# EAGLE design rect_and_stab (EAGLE 7.5.0)
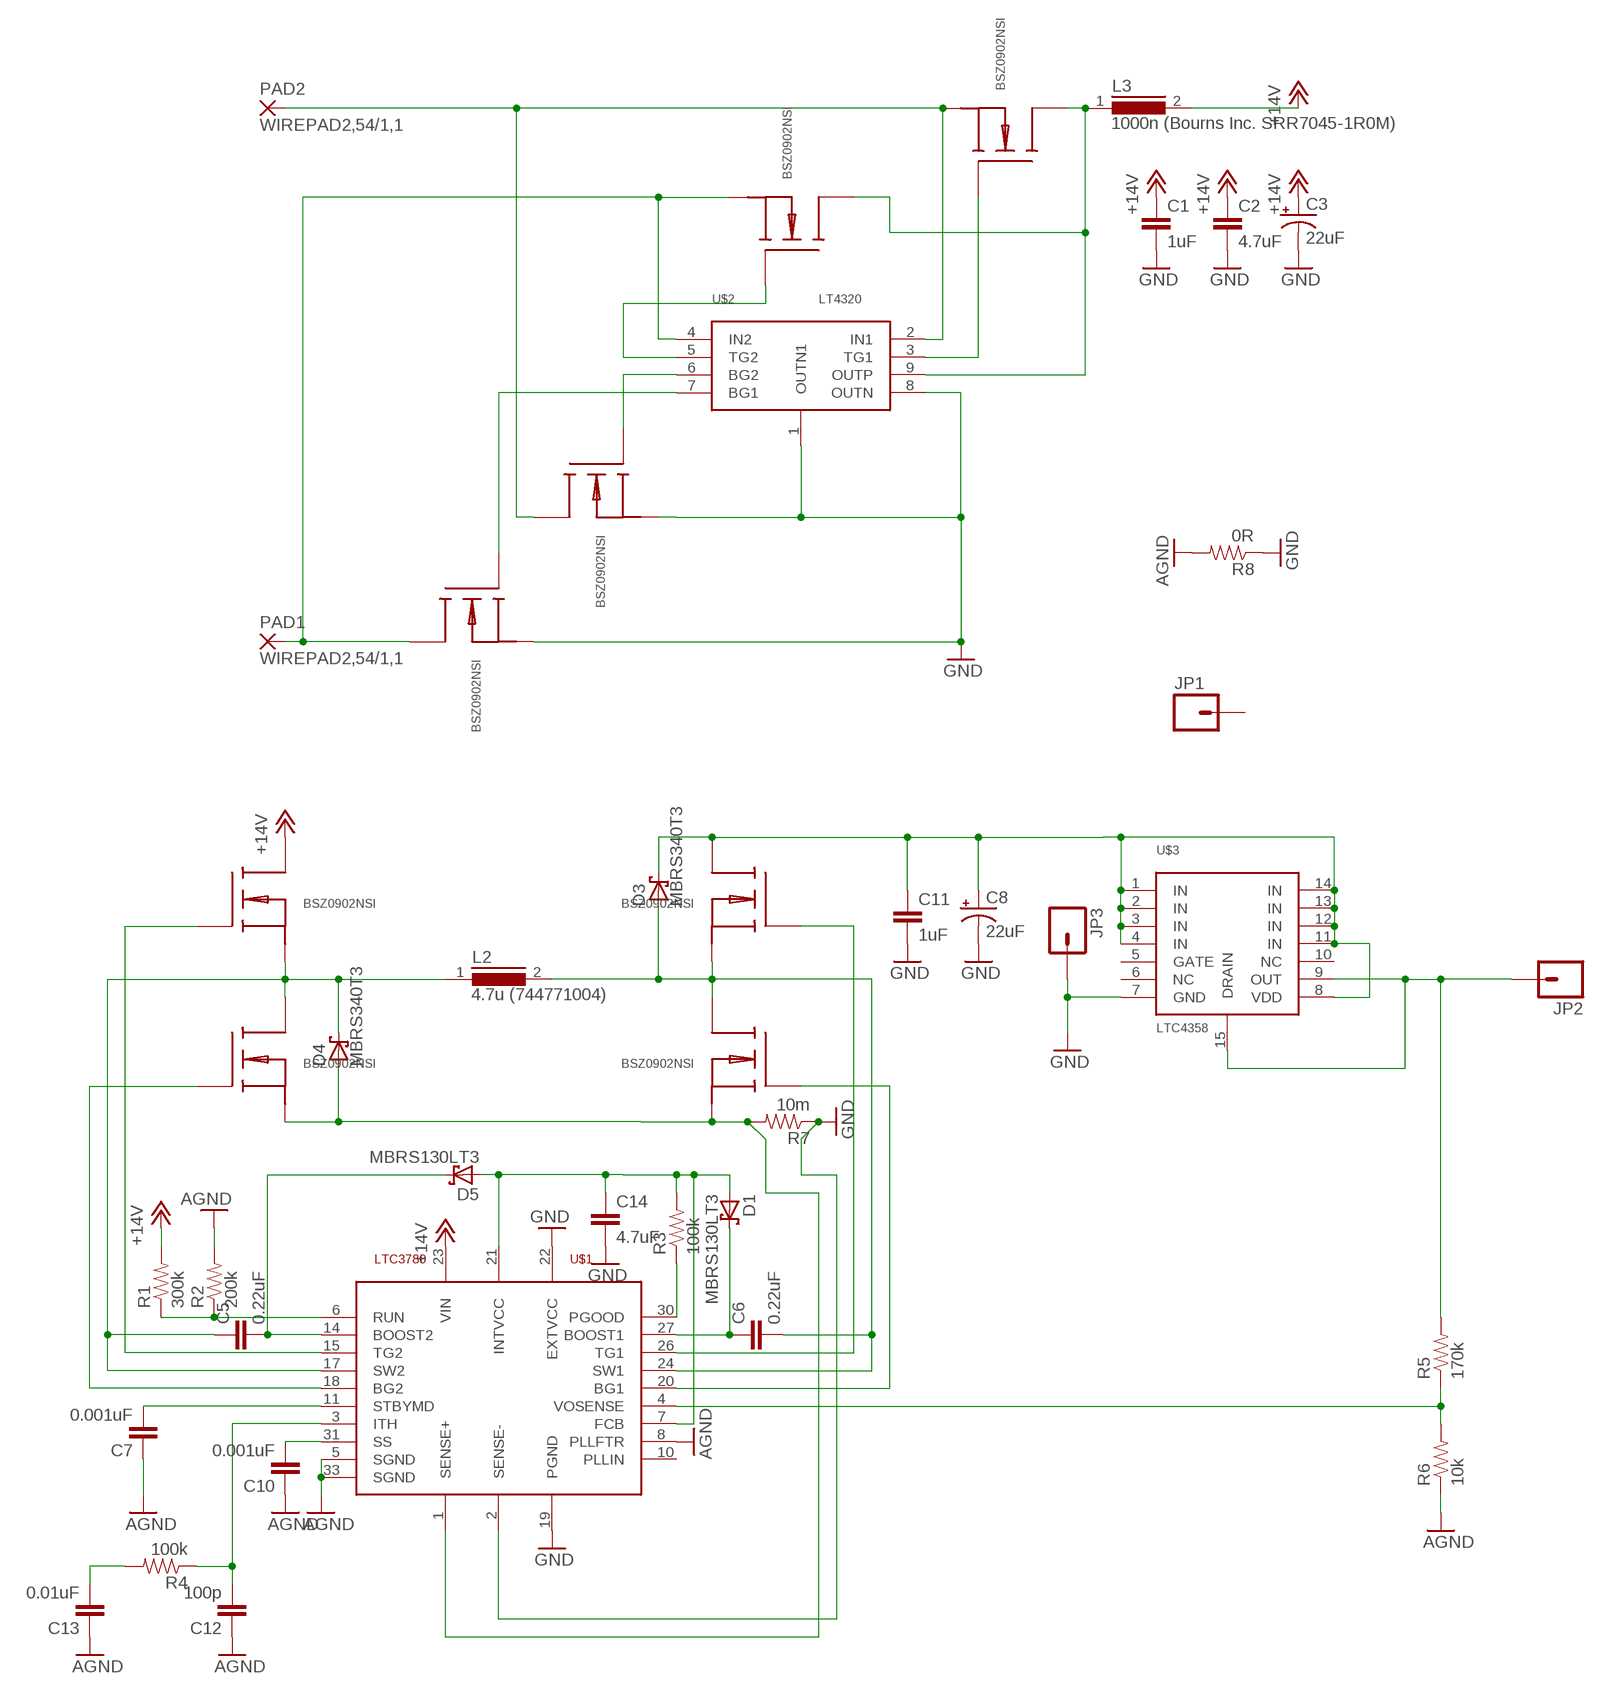
[diagram p0: schematic, sheet 1]

## Parts
C1  1uF  CAP0603-CAP  [0603-CAP]
C2  4.7uF  CAP1210  [1210]
C3  22uF  CAP_POL7343  [EIA7343]
C5  0.22uF  CAP0603-CAP  [0603-CAP]
C6  0.22uF  CAP0603-CAP  [0603-CAP]
C7  0.001uF  0.1UF-16V(+-10%)(0402)  [0402-CAP]
C8  22uF  CAP_POL7343  [EIA7343]
C10  0.001uF  0.1UF-16V(+-10%)(0402)  [0402-CAP]
C11  1uF  CAP0603-CAP  [0603-CAP]
C12  100p  0.1UF-16V(+-10%)(0402)  [0402-CAP]
C13  0.01uF  0.1UF-16V(+-10%)(0402)  [0402-CAP]
C14  4.7uF  CAP1210  [1210]
D1  MBRS130LT3  [SMB]
D3  MBRS340T3  [SMC]
D4  MBRS340T3  [SMC]
D5  MBRS130LT3  [SMB]
JP1  M01PTH_2MM  [1X01_2MM]
JP2  M01PTH_2MM  [1X01_2MM]
JP3  M01PTH_2MM  [1X01_2MM]
L2  4.7u (744771004)  DR127  [DR127]
L3  1000n (Bourns Inc. SRR7045-1R0M)  DR74  [DR74]
PAD1  WIREPAD2,54/1,1  [2,54/1,1]
PAD2  WIREPAD2,54/1,1  [2,54/1,1]
Q1  BSZ0902NSI  BSZ090X  [BSZ090X]
Q2  BSZ0902NSI  BSZ090X  [BSZ090X]
Q3  BSZ0902NSI  BSZ090X  [BSZ090X]
Q4  BSZ0902NSI  BSZ090X  [BSZ090X]
Q5  BSZ0902NSI  BSZ090X  [BSZ090X]
Q6  BSZ0902NSI  BSZ090X  [BSZ090X]
Q7  BSZ0902NSI  BSZ090X  [BSZ090X]
Q8  BSZ0902NSI  BSZ090X  [BSZ090X]
R1  300k  RESISTOR0402-RES  [0402-RES]
R2  200k  RESISTOR0402-RES  [0402-RES]
R3  100k  RESISTOR0402-RES  [0402-RES]
R4  100k  RESISTOR0402-RES  [0402-RES]
R5  170k  RESISTOR0402-RES  [0402-RES]
R6  10k  RESISTOR0402-RES  [0402-RES]
R7  10m  RESISTOR2010  [R2010]
R8  0R  RESISTOR0402-RES  [0402-RES]
U$1  LTC3780  [LTC3780]
U$2  LT4320  [LT4320]
U$3  LTC4358  [LTC4358]

## Nets
+12V [HI_PWR]: C1.1 C2.1 C3.A(+) L3.2 Q6.D Q6.D@1(D) Q6.D@2(D) Q6.D@3(D) Q6.D@4(D) R1.2 U$1.23(VIN) ; supply symbol labelled +14V
AGND: C7.1 C10.1 C12.1 C13.1 R2.2 R6.1 R8.2 U$1.5(SGND) U$1.8(PLLFTR) U$1.33(SGND)
GND [HI_PWR]: C1.2 C2.2 C3.C(-) C8.C(-) C11.2 C14.2 JP3.1 Q1.S@1(S) Q1.S@2(S) Q1.S@3(S) Q1.S@4(S) Q3.S@1(S) Q3.S@2(S) Q3.S@3(S) Q3.S@4(S) R7.1 R8.1 U$1.2(SENSE-) U$1.19(PGND) U$1.22(EXTVCC) U$2.1(OUTN1) U$2.8(OUTN) U$3.7(GND)
N$1 [HI_PWR]: Q2.G U$2.5(TG2)
N$2 [HI_PWR]: PAD1.1(P) Q2.S@1(S) Q2.S@2(S) Q2.S@3(S) Q2.S@4(S) Q3.D Q3.D@1(D) Q3.D@2(D) Q3.D@3(D) Q3.D@4(D) U$2.4(IN2)
N$3 [HI_PWR]: Q3.G U$2.7(BG1)
N$4: C7.2 U$1.11(STBYMD)
N$5: C6.1 D1.C U$1.27(BOOST1)
N$6 [HI_PWR]: Q1.G U$2.6(BG2)
N$7 [HI_PWR]: PAD2.1(P) Q1.D Q1.D@1(D) Q1.D@2(D) Q1.D@3(D) Q1.D@4(D) Q4.S@1(S) Q4.S@2(S) Q4.S@3(S) Q4.S@4(S) U$2.2(IN1)
N$8 [HI_PWR]: Q4.G U$2.3(TG1)
N$9 [HI_PWR]: L3.1 Q2.D Q2.D@1(D) Q2.D@2(D) Q2.D@3(D) Q2.D@4(D) Q4.D Q4.D@1(D) Q4.D@2(D) Q4.D@3(D) Q4.D@4(D) U$2.9(OUTP)
N$10: Q7.G U$1.20(BG1)
N$11 [HI_PWR]: C6.2 D3.A L2.2 Q7.D Q7.D@1(D) Q7.D@2(D) Q7.D@3(D) Q7.D@4(D) Q8.S@1(S) Q8.S@2(S) Q8.S@3(S) Q8.S@4(S) U$1.24(SW1)
N$12: C10.2 U$1.31(SS)
N$13 [HI_PWR]: JP2.1 R5.2 U$3.9(OUT) U$3.15(DRAIN)
N$14: Q8.G U$1.26(TG1)
N$15: Q5.G U$1.18(BG2)
N$16 [HI_PWR]: C5.1 D4.C L2.1 Q5.D Q5.D@1(D) Q5.D@2(D) Q5.D@3(D) Q5.D@4(D) Q6.S@1(S) Q6.S@2(S) Q6.S@3(S) Q6.S@4(S) U$1.17(SW2)
N$17 [HI_PWR]: Q6.G U$1.15(TG2)
N$18: C5.2 D5.C U$1.14(BOOST2)
N$19: R5.1 R6.2 U$1.4(VOSENSE)
N$20: R1.1 R2.1 U$1.6(RUN)
N$21: R3.1 U$1.30(PGOOD)
N$22 [HI_PWR]: C8.A(+) C11.1 D3.C Q8.D Q8.D@1(D) Q8.D@2(D) Q8.D@3(D) Q8.D@4(D) U$3.1(IN) U$3.2(IN) U$3.3(IN) U$3.4(IN) U$3.8(VDD) U$3.11(IN) U$3.12(IN) U$3.13(IN) U$3.14(IN)
N$23 [HI_PWR]: D4.A Q5.S@1(S) Q5.S@2(S) Q5.S@3(S) Q5.S@4(S) Q7.S@1(S) Q7.S@2(S) Q7.S@3(S) Q7.S@4(S) R7.2 U$1.1(SENSE+)
N$24: C13.2 R4.2
N$25: C12.2 R4.1 U$1.3(ITH)
N$26: C14.1 D1.A D5.A R3.2 U$1.7(FCB) U$1.21(INTVCC)
Unconnected: JP1.1 U$1.9(NC) U$1.10(PLLIN) U$1.12(NC) U$1.13(NC) U$1.16(NC) U$1.25(NC) U$1.28(NC) U$1.29(NC) U$1.32(NC) U$3.5(GATE) U$3.6(NC) U$3.10(NC)

## Library data of the parts
C1 C2 C5 C6 C11 C14 = SparkFun-Passives:CAP: Capacitor Standard 0603 ceramic capacitor, and 0.1" leaded capacitor.
C3 C8 = SparkFun-Passives:CAP_POL: Capacitor Polarized These are standard SMD and PTH capacitors. Normally 10uF, 47uF, and 100uF in electrolytic and tantalum varieties. Always verify the external diameter of the through hole cap, it varies with capacity, voltage, and manufacturer. The EIA devices should be standard.
C7 C10 C12 C13 = SparkFun-Capacitors:0.1UF-16V(+-10%)(0402); PROD_ID: CAP-12416; VALUE: 0.1uF
D1 D5 = diode:MBRS130LT3: Schottky Power Rectifier Source: http://www.onsemi.com/pub/Collateral/MBRS130LT3-D.PDF
D3 D4 = diode:MBRS3*0T3: SCHOTTKY BARRIER RECTIFIER 3.0 AMPERES 20, 30, 40 VOLT Source: MBRS340T3-D.pdf
JP1-JP3 = SparkFun-Connectors:M01: Header 1 Standard 1-pin 0.1" header. Use with straight break away headers (SKU : PRT-00116), right angle break away headers (PRT-00553), swiss pins (PRT-00743), machine pins (PRT-00117), and female headers (PRT-00115).
L2 = inductors:DR127: High Power Density, High Efficiency, Shielded Inductors Source: coiltronics_dr_series.pdf
L3 = inductors:DR74: High Power Density, High Efficiency, Shielded Inductors Source: coiltronics_dr_series.pdf
PAD1 PAD2 = wirepad:WIREPAD: Wire PAD connect wire on PCB
Q1-Q8 = vsd_custom:BSZ090X
R1-R8 = SparkFun-Passives:RESISTOR: Resistor Basic schematic elements and footprints for 0603, 1206, and PTH resistors.
U$1 = ltc3780:LTC3780
U$2 = lt4320:LT4320
U$3 = ltc4358:LTC4358

## Net classes
1 HI_PWR: width 0.3 mm, drill 0.4 mm, clearance 0.178 mm

## Board
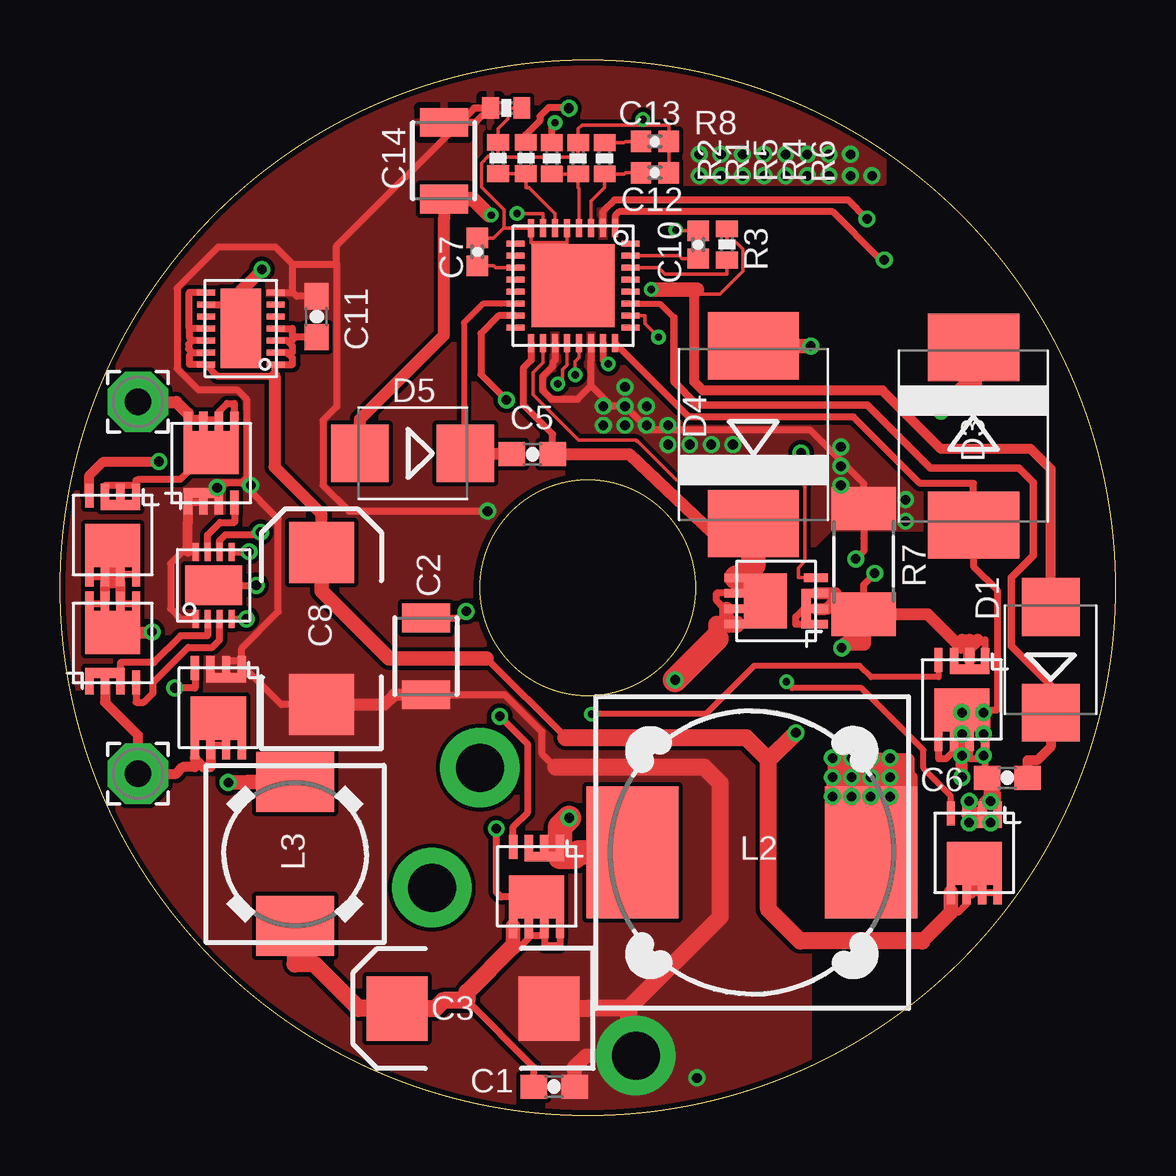
[diagram p1: board, top side]
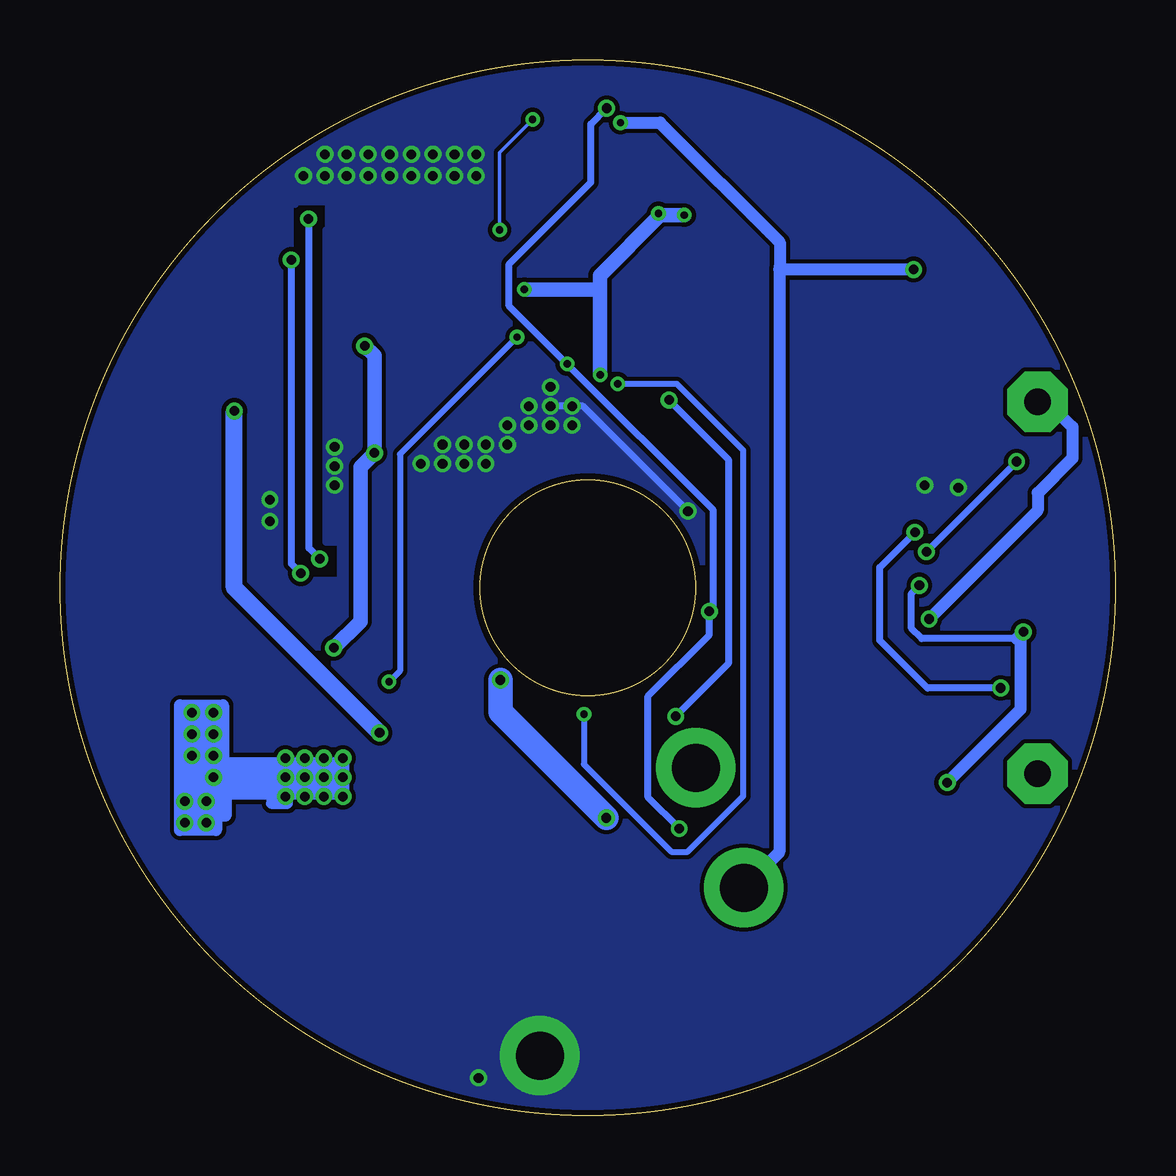
[diagram p2: board, bottom side, seen from below]

Size 44 x 44 mm. Coordinates in mm from the lower left corner, seen from the top.
Outline: circle at 22,22 radius 22
Outline: circle at 22,22 radius 4.5
Copper layers (1*16): Top 0.035mm / dielectric 1.5mm / Bottom 0.035mm
Design rules "SeeedStudio_2layer_DRU_no_angle_20140221": minimum track width 6mil, minimum drill 12mil, track to track 6mil, track to pad 6mil, pad to pad 6mil, via to via 6mil, smd to smd 0mil, copper to edge 10mil, drill to drill 10mil, minimum pad ring 10mil, minimum via ring 6mil, stop-mask expansion 2mil, vias tented up to drill 100mil, thermal gap 10mil

### Footprints (pad centres in the part's own frame; a part is rotated, then mirrored left to right if it is on the bottom)
0603-CAP = smd 1.1 x 1: 1 -0.85,0; 2 0.85,0
1210 = smd 1.2 x 2: 1 -1.6,0; 2 1.6,0
EIA7343 = smd 2.55 x 2.7: A 3.17,0; C -3.17,0
0402-CAP = smd 0.85 x 0.9: 1 -0.58,0; 2 0.58,0
SMB = smd 2.4 x 2.4: A 2.2,0; C -2.2,0
SMC = smd 2.8 x 3.8: A 3.7,0; C -3.7,0
1X01_2MM = drill 2 pad 3.302: 1 0,0
DR127 = smd 3.85 x 5.5: 1 -4.975,0; 2 4.975,0
DR74 = smd 2.5 x 3.25: 1 -3,0; 2 3,0
2,54/1,1 = drill 1.118 pad 2.54 octagon: 1 0,0
BSZ090X = smd 1.8 x 2.3: D 0.44,0 | smd 1 x 0.35: D@1 1.65,-0.975; D@2 1.65,-0.325; D@3 1.65,0.325; D@4 1.65,0.975; G -1.65,-0.975; S@2 -1.65,-0.325; S@3 -1.65,0.325; S@4 -1.65,0.975 | smd 0.4 x 1.65: S@1 -1.25,0.325
0402-RES = smd 0.7 x 0.9: 1 -0.65,0; 2 0.65,0
R2010 = smd 1.8 x 2.7: 1 -2.2,0; 2 2.2,0
LTC3780 = smd 0.75 x 0.25: 1 -2.4,1.75; 2 -2.4,1.25; 3 -2.4,0.75; 4 -2.4,0.25; 5 -2.4,-0.25; 6 -2.4,-0.75; 7 -2.4,-1.25; 8 -2.4,-1.75; 17 2.4,-1.75; 18 2.4,-1.25; 19 2.4,-0.75; 20 2.4,-0.25; 21 2.4,0.25; 22 2.4,0.75; 23 2.4,1.25; 24 2.4,1.75 | smd 0.25 x 0.75: 9 -1.75,-2.4; 10 -1.25,-2.4; 11 -0.75,-2.4; 12 -0.25,-2.4; 13 0.25,-2.4; 14 0.75,-2.4; 15 1.25,-2.4; 16 1.75,-2.4; 25 1.75,2.4; 26 1.25,2.4; 27 0.75,2.4; 28 0.25,2.4; 29 -0.25,2.4; 30 -0.75,2.4; 31 -1.25,2.4; 32 -1.75,2.4 | smd 3.45 x 3.45: 33 0,0
LT4320 = smd 0.25 x 0.75: 1 -0.75,-1.4; 2 -0.25,-1.4; 3 0.25,-1.4; 4 0.75,-1.4; 5 0.75,1.4; 6 0.25,1.4; 7 -0.25,1.4; 8 -0.75,1.4 | smd 2.38 x 1.65: 9 0,0
LTC4358 = smd 0.25 x 0.75: 1 -1.5,-1.45; 2 -1,-1.45; 3 -0.5,-1.45; 4 0,-1.45; 5 0.5,-1.45; 6 1,-1.45; 7 1.5,-1.45; 8 1.5,1.45; 9 1,1.45; 10 0.5,1.45; 11 0,1.45; 12 -0.5,1.45; 13 -1,1.45; 14 -1.5,1.45 | smd 3.3 x 1.7: 15 0,0

### Placement (x,y rotation side)
C1  20.6,1.2 0 top
C2  15.25,19.14 270 top
C3  17.22,4.46 180 top
C5  19.69,27.57 180 top
C6  39.49,14.08 180 top
C7  17.4,36 270 top
C8  10.9,20.3 90 top
C10  26.6,36.3 270 top
C11  10.7,33.3 90 top
C12  24.8,39.3 180 top
C13  24.8,40.6 180 top
C14  16,39.8 90 top
D1  41.3,19 90 top
D3  38.08,28.32 270 top
D4  28.9,28.38 90 top
D5  14.7,27.6 180 top
JP1  17.5,14.5 0 top
JP2  15.5,9.5 0 top
JP3  24,2.5 0 top
L2  28.84,10.96 0 top
L3  9.8,10.9 270 top
PAD1  3.25,29.75 90 top
PAD2  3.25,14.25 0 top
Q1  6.6,17 270 top
Q2  2.2,24.2 270 top
Q3  6.3,27.2 90 top
Q4  2.2,19.7 90 top
Q5  29.85,21.45 180 top
Q6  19.87,9.55 270 top
Q7  37.59,17.35 270 top
Q8  38.11,10.95 270 top
R1  19.42,39.91 90 top
R2  18.26,39.91 90 top
R3  27.8,36.31 90 top
R4  22.7,39.9 90 top
R5  20.5,39.9 90 top
R6  21.6,39.9 270 top
R7  33.5,23.1 270 top
R8  18.6,42 0 top
U$1  21.39,34.59 270 top
U$2  6.4,22.1 0 top
U$3  7.54,32.81 90 top

### Tracks (layer width: path | path; a pad name or v marks a point on that pad's centre or on a via)
+12V  (via drill 0.3 pad 0.61, 0.4 pad 0.61)
  Top 0.3: v21.21,41.99 21.18,42.02 20.37,42.02 20,41.66 20,41.48 19.42,40.9 R1.2 | 20.2,7.49 20.2,7.07 20.84,7.07 Q6.D@4 | Q6.D@3 20.2,7.49 | 19.55,7.49 19.55,7.41 19.21,7.07 18.89,7.07 | 19.55,7.49 19.55,7.8 Q6.D@2 19.55,8.73 19.51,8.73 19.13,9.11 | 20.2,7.49 19.55,7.49 | 19.13,9.11 18.39,9.11 18.19,9.32 v18.19,11.96 | Q6.D 19.13,9.11 | 16.96,4.79 19.72,2.03 19.75,2.03 C1.1 | U$1.23 22.64,31.49 22.7,31.49 v22.86,31.33 | C2.1 16.58,20.74 16.86,21.02 v16.93,21.02
  Top 0.6: Q6.D@1 18.89,7.07
  Top 0.7: 18.89,7.07 16.96,5.14 16.96,4.79 15.99,4.79 15.65,4.46 C3.A 12.45,4.46 10.59,6.32 9.8,6.32 L3.2
  Bottom 0.3: v21.21,41.99 21.87,41.33 21.87,38.9 25.28,35.5 25.28,33.75 v22.86,31.33 16.79,25.26 16.79,21.06 v16.93,21.02 16.93,20.03 19.48,17.48 19.48,13.26 v18.19,11.96
AGND  (via drill 0.3 pad 0.61)
  Top 0.152: 18.26,39.98 18.3,39.95 21.57,39.95 21.6,39.97 R6.1 21.6,41.13 21.75,41.28 24.3,41.28 | 18.51,36.99 18.51,37.76 17.58,38.69 17.58,39.71 17.85,39.98 18.26,39.98 | 18.51,36.99 U$1.8 19.64,36.39 21.14,36.39 | 18.51,36.99 18.49,36.99 18.08,36.58 C7.1 | 18.26,39.98 R2.2 18.26,41.14 18.67,41.55 18.67,42 R8.2 | v25.67,36.92 25.88,36.92 25.92,36.88 C10.1 | 24.3,41.28 25.38,41.28 C13.1 C12.1 | 24.3,41.28 v24.3,41.52 | 21.14,36.39 U$1.5 | U$1.33 21.14,34.84 21.14,36.39
  Bottom 0.152: v24.3,41.52 25.67,40.14 v25.67,36.92
GND  (via drill 0.4 pad 0.61)
  Top 0.3: 9.69,35.49 8.98,36.2 6.6,36.2 4.88,34.48 4.88,31.14 5.76,30.25 7.38,30.25 7.78,29.86 7.78,26.57 7.59,26.38 | U$2.1 5.04,20.7 4.61,21.13 4.61,23.01 5.1,23.5 5.33,23.5 U$2.8 | v33.64,37.37 32.86,38.16 23.1,38.16 22.64,37.69 U$1.2 | 22.14,30.43 23,29.57 v23.55,29.57 24.53,28.59 31.25,28.59 33.5,26.35 R7.1 33.5,24.07 33.5,23.53 v33.17,23.2 | 11.53,35.49 11.53,29.55 10.97,28.98 10.97,26.27 12.04,25.19 v17.82,25.19 | 11.53,35.49 11.53,36.26 17.27,42 R8.1 17.93,42 17.33,41.4 C14.2 | 9.69,35.49 11.53,35.49 | 9.69,34.31 9.69,35.49 | 22.14,30.43 22.14,31.49 U$1.22 | 22.14,30.43 21.58,29.86 20.48,29.86 20.11,30.23 20.11,30.8 20.54,31.22 20.54,31.39 20.64,31.49 U$1.19 | 9.69,34.31 9.71,34.31 9.87,34.15 C11.2 | U$3.7 9.69,34.31 | Q3.S@4 Q3.S@3 Q3.S@1 5.99,25.96 6.62,25.96 | 7.59,26.38 9.1,24.87 9.1,21 7.58,19.48 7.58,18.94 | 20.66,14.51 20.1,15.07 20.1,16 18.54,17.54 16.58,17.54 C2.2 14.59,17.54 | Q1.S@2 6.28,18.22 6.3,18.3 6.9,18.3 | 6.9,18.3 Q1.S@3 6.92,18.94 7.58,18.94 | 6.9,18.3 Q1.S@1 6.9,18.3 | 6.62,25.96 6.62,26.38 7.59,26.38 | Q3.S@2 6.62,25.96 | 7.58,18.94 Q1.S@4 7.58,18.46 7.9,18.46 9.22,17.13 C8.C
  Top 0.406: 5.33,23.5 5.33,24.72 Q3.S@4
  Top 0.5: C8.C 13.51,17.13 13.92,17.54 14.59,17.54
  Top 0.6: JP3.1 23.69,2.5 21.92,2.5 21.45,2.03 C1.2
  Top 0.7: 23.69,4.46 27.52,8.29 27.52,13.85 26.85,14.51 21.57,14.51 20.66,14.51 | 23.69,4.46 23.69,2.5 | 23.69,4.46 21.99,4.46 C3.C
  Bottom 0.3: v33.17,23.2 33.62,23.65 33.62,37.16 | 33.62,37.16 | 33.62,37.16 v33.64,37.37 | v17.82,25.19 22.2,29.57 v23.55,29.57
  other vias: 22.65,29.57 22.65,28.77 23.55,28.77 23.55,30.37 24.45,29.57 24.45,28.77 25.35,28.77 25.35,27.97 26.25,27.97 26.25,27.17 27.15,27.17 27.15,27.97 28.05,27.97 28.05,27.17 28.95,27.17 32.55,27.87 32.55,27.07 32.55,26.27 35.25,24.77 35.25,25.67 33.85,39.17 32.95,39.17 32.05,39.17 31.15,39.17 30.25,39.17 29.35,39.17 28.45,39.17 27.55,39.17 26.65,39.17 26.55,1.57 32.95,40.07 32.05,40.07 31.15,40.07 30.25,40.07 29.35,40.07 28.45,40.07 27.55,40.07 26.65,40.07 6.55,26.17 7.95,26.27
  pour Bottom (no thermals): -2.6,47.9 38.1,47.9 38.1,38 34.2,38 34.2,38.1 32.8,38.1 32.8,36.9 32.9,36.9 32.9,24.1 32.9,23.9 32.3,23.9 32.3,22.6 32.3,22.5 32.3,22.3 34.4,22.3 34.4,37.8 50,37.8 50,-0.8 -2.6,-0.8
  pour Top (no thermals): 34.6,41.7 34.4,41.7 34.4,36.4 33.5,36.4 32.2,37.7 4.9,37.7 0.8,33.6 0.8,29.1 -0.5,27.8 -0.5,13.4 12.9,0 29.6,0 31.2,1.6 31.2,23.6 32.1,24.5 44.8,24.5 47.5,27.2 47.5,28.8
  pour Top: 4.3,37.8 21.7,37.8 22.8,38.9 34.3,38.9 34.3,40.2 31.5,43 28.3,43 27.2,44.1 10.6,44.1
N$1  (via drill 0.4 pad 0.61)
  Top 0.3: U$2.5 v7.88,23.5
  Top 0.406: v4.12,27.26 1.81,27.26 1.23,26.68 Q2.G
  Bottom 0.3: v7.88,23.5 v4.12,27.26
N$2  (via drill 0.4 pad 0.61)
  Top 0.3: 6.14,27.64 6.14,27.86 5.97,28.02 Q3.D@3 5.97,28.95 5.97,29 | 3.17,26.26 3.17,26.48 3.22,26.48 3.28,26.52 5.02,26.52 6.14,27.64 | Q2.S@4 3.17,26.26 | 3.17,26.26 2.52,26.26 | Q3.D 6.14,27.64 | 2.52,26.26 1.89,26.26 Q2.S@2 | 2.52,26.26 Q2.S@3 Q2.S@1 | U$2.4 v7.77,20.7 | 6.62,29 6.62,29.26 6.62,29.34 6.96,29.68 7.28,29.68 Q3.D@1 | Q3.D@2 6.62,29 | 5.97,29 5.97,29.06 5.33,29.06 | 5.97,29 6.62,29 | 5.33,29.06 5.33,29.26 | Q3.D@4 5.33,29.06 | 4.85,29.74 4.85,29.75
  Top 0.5: 5.33,29.26 4.85,29.74 | PAD1.1 4.85,29.75
  Bottom 0.5: PAD1.1 3.15,29.45 2.4,29.3 1.8,28.7 1.8,27.4 3.25,25.95 3.25,25.22 v7.77,20.7
N$3
  Top 0.3: Q3.G 7.28,24.72 6.67,24.72 6.15,24.2 U$2.7
N$4
  Top 0.152: C7.2 18.08,35.42 18.16,35.34 U$1.11
N$5
  Top 0.152: 41.3,17.93 D1.C 41.3,16.09
  Top 0.25: U$1.27 25,33.84 25.59,33.25
  Top 0.305: 41.3,17.93 39.65,19.57 39.65,22.43 40.58,23.35 40.58,26.38 39.96,26.99 36.28,26.99 33.65,29.62 26.56,29.62 25.59,30.59 25.59,33.25
  Top 0.406: 41.3,16.09 41.3,15.37 40.74,14.81 40.34,14.81 C6.1
N$6  (via drill 0.4 pad 0.61)
  Top 0.3: U$2.6 6.65,23.96 6.9,24.21 8.01,24.21 8.1,24.3 v8.36,24.31 | v4.78,17.82 5.62,17.82 Q1.G
  Bottom 0.3: v4.78,17.82 7.84,17.82 9.83,19.81 9.83,22.85 v8.36,24.31
N$7
  Top 0.3: Q4.S@3 Q4.S@1 | Q4.S@1 1.89,18.46 2.52,18.46 | 2.52,18.46 2.52,18.88 3.91,18.88 5.03,20 6.15,20 U$2.2 | Q4.S@2 2.52,18.46 | 7.12,16.04 7.26,16.18 7.58,16.18 Q1.D@4 | 6.92,15.45 6.92,15.84 7.12,16.04 | 7.12,16.04 Q1.D | 6.92,15.45 6.28,15.45 Q1.D@2 | Q1.D@3 6.92,15.45 | 1.88,17.22 | 5.62,14.86 5.62,14.94 Q1.D@1 | Q4.S@1 1.86,18.46 1.23,18.46 Q4.S@4
  Top 0.406: Q4.S@3 1.88,17.22 | 1.88,17.22 3.25,15.85 PAD2.1 4.85,14.25 5.12,14.52 5.62,14.52 5.62,14.94 | Q1.D@2 6.28,14.52 5.96,14.52 5.62,14.86
N$8
  Top 0.3: Q4.G 3.17,17.22 3.49,17.22 3.88,17.61 3.88,18.04 5.35,19.52 6.35,19.52 6.65,19.82 U$2.3
N$9  (via drill 0.4 pad 0.61)
  Top 0.3: 3.68,20.14 3.82,20.14 v3.84,20.16 | U$2.9 v8.18,22.1 | 1.88,22.5 2.37,22.5 2.2,22.53 | 2.2,22.53 2.51,22.53 Q2.D@3 Q2.D@4 | Q2.D 2.2,22.53 | 1.88,22.5 1.88,22.45 | Q2.D@2 1.88,22.5 | 1.88,22.18 1.88,22.45 | Q4.D@4 Q4.D@3 | Q4.D 2.94,20.14 2.56,20.52 2.52,20.52 Q4.D@2 Q4.D@1 | 1.88,22.45 1.33,22.45 Q2.D@1
  Top 0.406: Q4.D@2 2.52,22.18 1.88,22.18 Q4.D@3
  Top 0.5: 2.94,20.14 3.68,20.14 | 7.85,13.9 7.83,13.88
  Top 0.6: 7.83,13.88 v7.02,13.88 | L3.1 7.85,13.9
  Bottom 0.3: 4.12,19.88 3.95,19.88 8.08,19.88 8.51,20.31 8.51,21.77 v8.18,22.1
  Bottom 0.5: 4.12,19.88 v3.84,20.16 | v7.02,13.88 3.95,16.95 3.95,19.88
N$10  (via drill 0.3 pad 0.61)
  Top 0.152: U$1.20 21.14,31.29 20.94,31.09 20.94,30.69 v20.75,30.5
  Top 0.25: v22.16,16.73 26.92,16.73 28.93,18.75 33.34,18.75 33.81,18.27 36.62,18.27 Q7.G
  Bottom 0.25: v22.16,16.73 22.16,14.64 18.52,11 17.84,11 15.52,13.32 15.52,27.73 18.29,30.5 v20.75,30.5
N$11  (via drill 0.4 pad 0.61)
  Top 0.3: U$1.24 26.21,29.12 33.08,29.12 35.85,26.35 38.08,26.35 D3.A 38.08,22.89 39.07,21.9 39.07,16.91 Q7.D 37.59,16.3 | 38.64,13.29 38.77,13.43 39.09,13.43 Q8.S@4 | 38.64,13.29 38.44,13.09 Q8.S@3 Q8.S@1 | 38.64,13.67 38.64,13.29 | 37.27,15.6 37.5,15.6 37.59,15.68 37.59,16.1 37.59,16.3 | 37.27,15.6 37.27,15.21 36.93,14.87 36.62,14.87 Q7.D@1 | Q7.D@2 37.27,15.6 | 37.59,16.3 37.91,15.97 Q7.D@3 37.91,14.87 38.56,14.87 | 38.56,14.87 Q7.D@4 | 38.64,13.67 38.56,13.74 38.56,14.87 | C6.2 38.64,13.67
  Top 0.406: v32.2,14.1 v33,14.1 | v33,14.9 v33.8,14.9 | v33.8,14.9 v33.8,14.1 | v34.6,14.9 v33.8,14.9 | v32.2,14.9 32.4,14.9 35.4,14.9 35.4,14.2 32.4,14.2 32.5,14.4 35.1,14.4 35.1,14.7 32.4,14.7 32.2,14.7 v32.2,13.3 | v37.6,16.8 v37.59,16.8 Q7.D | 37.59,16.1 37.6,16.1 v37.6,15.9 | v38.5,16.8 38.5,16.7 | 38.5,16.7 v38.5,15.9 | 38.5,16.7 38.56,16.7 Q7.D@4 | 38.56,14.87 38.5,14.87 v38.5,15
  Top 0.5: L2.2 32.2,10.96 v32.2,13.3 32.2,13.8 35.2,13.8 35.2,12.8 35.5,12.8 35.5,14.1 v33.8,14.1 v33,14.1 v32.2,14.1 | v37.6,14.1 v37.59,14.1 37.59,16.1 | Q8.S@3 Q8.S@2
  Bottom 0.406: 32.2,13.4 33,13.4 v33,13.3 | v33.8,13.3 v33.8,14.1 | v34.6,14.1 34.7,14.1 | v34.6,13.3 35.2,13.3 35.2,13 34.5,13 34.5,13.4 | v37.9,13.1 v38.8,13.1 v38.8,12.2 | 37.9,12.1 v37.9,12.2 | v37.9,12.2 37.9,13 v37.9,12.2 | v38.8,12.2 Q8.S@1 v38.8,12.2 | 37.5,14.7 37.6,14.7 v37.6,15
  Bottom 0.5: v32.2,14.1 32.2,13.7 32.2,13.4 34.5,13.4 37.1,13.4 37.1,12.5 38.2,12.5 38.2,16.3 37.9,16.3 37.9,14.7 37.5,14.7 37.5,16.7 38.6,16.7 38.6,12.1 37.9,12.1 v37.9,12.2 37.9,13 v37.9,13.1 37.9,14.4 32.2,14.4 32.2,13.8 37.5,13.8 37.5,11.9 39,11.9 39,17.1 37.2,17.1 37.2,14.7 32.2,14.7 v32.2,14.1 | v32.2,14.1 v33.8,14.1 v34.6,14.1 34.7,14.1 v37.6,14.1
N$12
  Top 0.152: C10.2 25.92,35.72 25.8,35.84 U$1.31
N$13  (via drill 0.3 pad 0.61, 0.4 pad 0.61)
  Top 0.3: 7.08,33.81 7.08,33.93 | U$3.15 7.54,33.35 7.08,33.81 | 7.08,33.81 6.79,33.81 U$3.9 | v20.63,41.39 20.63,41.36 20.5,41.23 R5.2
  Top 0.5: 7.08,33.93 v8.42,35.27
  Bottom 0.5: v8.42,35.27 14.01,35.27 | 14.01,35.27 14.01,10.99 JP2.1 | v20.63,41.39 18.99,41.39 14,36.4 14,35.4 14.01,35.27
N$14  (via drill 0.3 pad 0.61)
  Top 0.152: v24.95,32.45 24.39,33.01 24.39,33.34 U$1.26
  Top 0.25: v30.28,18.08 30.53,17.82 33.41,17.82 35.99,15.24 35.99,14.47 37.13,13.33 Q8.G
  Bottom 0.25: v24.95,32.45 29.83,27.57 29.83,18.53 v30.28,18.08
N$15
  Top 0.152: U$1.18 20.14,31.59 20.14,31.58 20.14,31.39 19.71,30.96 19.71,30.06 21.62,28.15 23.99,28.15 24.1,28.1 25.7,26.5 30.8,26.5 31.06,26.24 31.06,26.19 31.06,23.11 30.77,22.83 30.77,22.43 Q5.G
N$16  (via drill 0.4 pad 0.61)
  Top 0.3: Q6.S@1 | Q6.S@1 19.86,10.77 19.55,10.77 Q6.S@2 | 20.2,11.1 Q6.S@1 | Q6.S@3 20.2,11.1 | 28.9,25.54 D4.C | 28.61,22.43 28.61,21.77 | 28.61,21.77 29.09,21.77 Q5.D | 28.61,21.77 Q5.D@2 27.37,21.77 27.37,21.46 27.71,21.12 27.79,21.12 27.99,21.12 Q5.D@3 | C5.1 20.54,28.4 19.31,29.63 19.31,31.15 19.64,31.49 U$1.17 | 20.84,11.1 Q6.S@4 | 20.84,10.99 20.84,11.1 | 20.84,11.1 20.2,11.1
  Top 0.5: 28.61,22.67 28.61,22.43 | 28.9,25.54 27.2,24.31 23.74,27.57 21.42,27.57 C5.1
  Top 0.6: 27.79,20.48 27.79,21.12
  Top 0.7: 27.37,19.89 27.37,20.48 27.79,20.48 Q5.D@4
  Top 1.016: D4.C 28.9,22.95 28.61,22.67 | Q5.D@1 28.61,22.43 | 27.37,19.89 v25.64,18.16 | v21.22,12.41 20.84,12.03 Q6.S@4 | 20.84,10.99 20.84,10.79 21.44,10.79 21.61,10.96 L2.1
  Bottom 1.016: v21.22,12.41 25.64,16.82 v25.64,18.16
N$17  (via drill 0.4 pad 0.61)
  Top 0.3: v18.61,29.83 17.55,30.89 17.55,32.6 18.29,33.34 U$1.15 | Q6.G 18.89,12.03 19.48,12.62 19.48,15.49 v18.33,16.64
  Bottom 0.3: v18.61,29.83 16.14,27.35 16.14,18.84 v18.33,16.64
N$18
  Top 0.152: 16.84,27.3 D5.C | 18.06,27.57 18.03,27.6
  Top 0.25: 16.84,27.3 16.84,33.05 17.63,33.84 18.39,33.84 U$1.14
  Top 0.5: 18.03,27.6 16.84,27.3 | C5.2 18.06,27.57
N$19
  Top 0.152: R5.1 21.18,39.25 21.47,38.96 21.6,38.96 | 21.6,38.96 21.6,38.67 21.64,38.63 U$1.4 | R6.2 21.6,38.96
N$20
  Top 0.152: R2.1 18.94,39.26 19.23,38.97 19.42,38.97 | 19.42,38.97 19.42,38.68 19.55,38.68 20.64,37.59 U$1.6 | R1.1 19.42,38.97
N$21
  Top 0.152: U$1.30 24.94,35.34 25.21,35.07 27.79,35.07 27.8,35.08 R3.1
N$22  (via drill 0.4 pad 0.61)
  Top 0.3: 5.51,31.81 6,31.81 U$3.13 | 5.52,32.31 5.36,32.15 5.36,31.96 5.51,31.81 | 5.51,31.81 5.39,31.68 5.39,31.31 U$3.14 6.09,31.29 6.55,30.83 8.94,30.83 8.99,31.28 U$3.1 9.69,31.31 9.69,31.57 9.46,31.81 | 5.52,32.31 6,32.31 U$3.12 | 5.39,32.81 5.39,32.44 5.52,32.31 | 9.46,31.81 U$3.2 | 9.46,31.81 9.69,31.81 9.69,32.08 9.46,32.31 | 9.46,32.31 U$3.3 | 9.46,32.31 9.69,32.31 9.69,32.45 | Q8.D@4 Q8.D@3 38.13,9.3 38.11,9.28 | 17.79,19.06 21.09,15.76 | 37.78,9.2 38.02,9.2 38.11,9.28 | 37.78,9.2 37.78,8.81 37.45,8.47 37.13,8.47 | Q8.D@2 37.78,9.2 | 9.69,32.45 9.69,32.81 U$3.4 | 9.69,32.45 9.87,32.45 C11.1 | Q8.D 38.11,9.28 | U$3.8 5.39,34.31 5.39,32.81 | U$3.11 5.39,32.81
  Top 0.5: 8.94,30.83 8.94,27.04 10.9,25.07 C8.A
  Top 0.6: 17.79,19.06 13.71,19.06 10.9,21.87 C8.A | 35.94,7.28 37.13,8.47 Q8.D@1
  Top 0.7: v36.73,29.37 37.65,30.29 38.08,30.29 D3.C | 29.54,14.82 v30.68,15.96 | 21.09,15.76 28.6,15.76 29.54,14.82 | 35.94,7.28 30.85,7.28 29.54,8.59 29.54,14.82
  Bottom 0.7: v30.68,15.96 36.73,22.01 v36.73,29.37
N$23  (via drill 0.4 pad 0.61)
  Top 0.3: v34.36,35.67 34.12,35.77 32.21,37.67 23.31,37.67 23.14,37.5 U$1.1 | v33.96,22.6 33.96,22.59 33.5,22.13 R7.2 32.89,20.9 32.33,21.46 | 31.13,32.08 v31.3,32.08 | 37.6,19.83 37.56,19.49 37.27,19.41 Q7.S@2 | 31.91,21.12 31.99,21.12 | Q7.S@4 38.56,19.83 38.25,19.83 | 37.91,19.49 37.91,19.41 37.91,19.83 | Q5.S@3 Q5.S@1 31.01,21.12 30.67,20.79 30.67,20.48 Q5.S@4 | Q7.S@3 Q7.S@1
  Top 0.5: 37.6,19.83 37.91,19.83 | R7.2 36.16,20.9 37.56,19.49 | 31.99,21.12 32.33,21.46 32.33,21.77 Q5.S@2 | Q5.S@3 31.91,21.12 | 37.91,19.49 38.25,19.83 | Q7.S@3 37.91,19.41
  Top 0.6: v32.59,19.49 32.77,19.67 33.5,19.67 R7.2 | D4.A 31.13,32.08
  Bottom 0.3: v34.36,35.67 34.36,23 v33.96,22.6
  Bottom 0.6: v32.59,19.49 31.48,20.6 31.48,27.03 v30.89,27.62 30.89,31.68 v31.3,32.08
N$24
  Top 0.152: C13.2 23.57,40.6 23.52,40.55 R4.2
N$25
  Top 0.152: C12.2 23.57,39.3 23.52,39.25 R4.1 22.7,38.67 22.14,38.11 U$1.3
N$26  (via drill 0.3 pad 0.61)
  Top 0.152: v21.48,30.87 21.48,31.42 21.64,31.59 U$1.21 | v21.48,30.87 | U$1.7 20.14,37.59 20.13,37.6 v19.05,37.6 | 17.89,37.53 v17.98,37.53 | 26.55,34.44 26.45,34.23 27.51,34.23 28.48,35.21 28.48,36.11 28.21,36.38 27.8,36.38 R3.2
  Top 0.406: D1.A 41.3,26.95 40.46,27.79 36.72,27.79 34.28,30.23 26.79,30.23 26.45,30.57 26.45,34.23
  Top 0.5: D5.A 12.5,29.03 16,32.53 16,37.37 C14.1
  Top 0.6: 17.89,37.53 17.23,38.2 C14.1 | 26.55,34.44 v24.64,34.44
  Bottom 0.152: 21.5,30.89 v21.48,30.87 | 18.98,37.53 v19.05,37.6
  Bottom 0.6: 21.5,34.44 21.5,30.89 | 21.5,34.44 21.5,35.02 18.98,37.53 v17.98,37.53 | 21.5,34.44 v24.64,34.44